# Altium schematic sheet LambdaIn.SchDoc
size A4; Organization: Altium Limited; Address1: L3, 12a Rodborough Rd; Address2: Frenchs Forest; Address3: NSW; Address4: Australia 2086
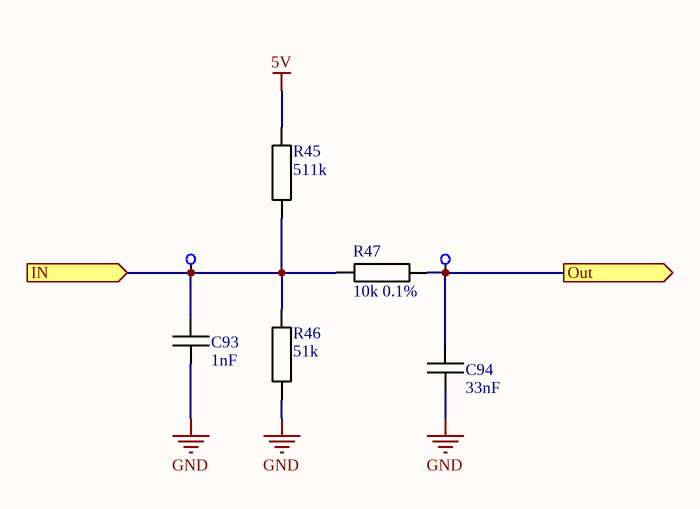
[diagram p0: LambdaIn.SchDoc]

## Parts
C93  1nF  [SMD 0603]
C94  33nF  [SMD 0603]
R45  511k  [SMD 0603]
R46  51k  [SMD 0603]
R47  10k 0.1%  [SMD 0603]
TP64  TestPoint  [TESTPOINT]  (value not drawn)
TP65  TestPoint  [TESTPOINT]  (value not drawn)

## Ports
IN (in), Out (out)

## Nets
5V: R45.1
GND: C93.1 C94.2 R46.2
IN: C93.2 R45.2 R46.1 R47.1 TP64.0 ; port IN
Out: C94.1 R47.2 TP65.0 ; port Out

## Notes on the sheet
- Title
- Size:
- Date:
- A4
- Number:
- Time:
- Revision:
- Sheet
- of
- File:

## Library data of the parts
C93 = Capasitor: CC0603KRX7R9BB102; Value: 1nF
C94 = Capasitor: CC0603JRX7R7BB333; Value: 33nF
R45 = Resistor: RC0603FR-07511KL; Value: 511k
R46 = Resistor: RC0603FR-0751KL; Value: 51k
R47 = Resistor: RT0603BRD0710KL; Value: 10k 0.1%